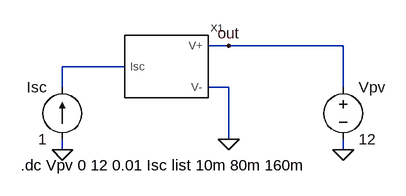
[diagram p0: schematic SolarCellTestBench.asc]
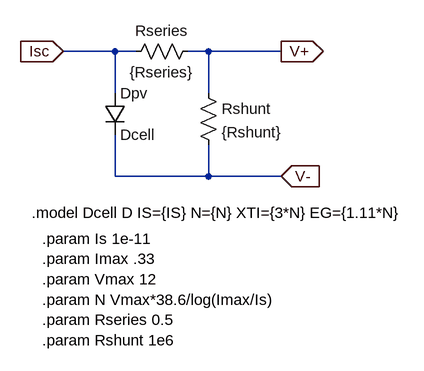
[diagram p1: sub-circuit solarcell.asc]
SolarCellTestBench.asc, the LTspice schematic file:
Version 4
SHEET 1 880 680
WIRE 272 144 240 144
WIRE 448 144 272 144
WIRE 112 176 16 176
WIRE 16 208 16 176
WIRE 272 208 240 208
WIRE 448 208 448 144
WIRE 272 288 272 208
WIRE 16 304 16 288
WIRE 448 304 448 288
FLAG 272 288 0
FLAG 16 304 0
FLAG 448 304 0
FLAG 272 144 out
SYMBOL SolarCell 176 176 R0
SYMATTR InstName X1
SYMBOL current 16 288 R180
WINDOW 0 24 80 Left 2
WINDOW 3 24 0 Left 2
WINDOW 123 0 0 Left 0
WINDOW 39 0 0 Left 0
SYMATTR InstName Isc
SYMATTR Value 1
SYMBOL voltage 448 192 R0
WINDOW 123 0 0 Left 0
WINDOW 39 0 0 Left 0
SYMATTR InstName Vpv
SYMATTR Value 12
TEXT -48 328 Left 2 !.dc Vpv 0 12 0.01 Isc list 10m 80m 160m

solarcell.asc, the sub-circuit schematic file:
Version 4
SHEET 1 1020 680
WIRE 304 112 224 112
WIRE 336 112 304 112
WIRE 448 112 416 112
WIRE 560 112 448 112
WIRE 304 176 304 112
WIRE 448 176 448 112
WIRE 304 304 304 240
WIRE 448 304 448 256
WIRE 448 304 304 304
WIRE 560 304 448 304
FLAG 224 112 Isc
IOPIN 224 112 In
FLAG 560 112 V+
IOPIN 560 112 Out
FLAG 560 304 V-
IOPIN 560 304 In
SYMBOL diode 288 176 R0
SYMATTR InstName Dpv
SYMATTR Value Dcell
SYMBOL res 432 160 R0
SYMATTR InstName Rshunt
SYMATTR Value {Rshunt}
SYMBOL res 432 96 R90
WINDOW 0 0 56 VBottom 2
WINDOW 3 32 56 VTop 2
SYMATTR InstName Rseries
SYMATTR Value {Rseries}
TEXT 176 360 Left 2 !.model Dcell D IS={IS} N={N} XTI={3*N} EG={1.11*N}
TEXT 192 400 Left 2 !.param Is 1e-11\n.param Imax .33\n.param Vmax 12\n.param N Vmax*38.6/log(Imax/Is)\n.param Rseries 0.5\n.param Rshunt 1e6

The netlist it stands for:
* SolarCellTestBench.asc
XX1 N001 out 0 solarcell
Isc 0 N001 1
Vpv out 0 12

* block symbol definitions
.subckt solarcell Isc V+ V-
Dpv Isc V- Dcell
Rshunt V+ V- {Rshunt}
Rseries V+ Isc {Rseries}
.model Dcell D IS={IS} N={N} XTI={3*N} EG={1.11*N}
.param Is 1e-11
.param Imax .33
.param Vmax 12
.param N Vmax*38.6/log(Imax/Is)
.param Rseries 0.5
.param Rshunt 1e6
.ends solarcell

.model D D
.lib standard.dio
.dc Vpv 0 12 0.01 Isc list 10m 80m 160m
.backanno
.end